# EAGLE design BIM BMI Adapter (EAGLE 5.12)
FUNCTION: JTAG
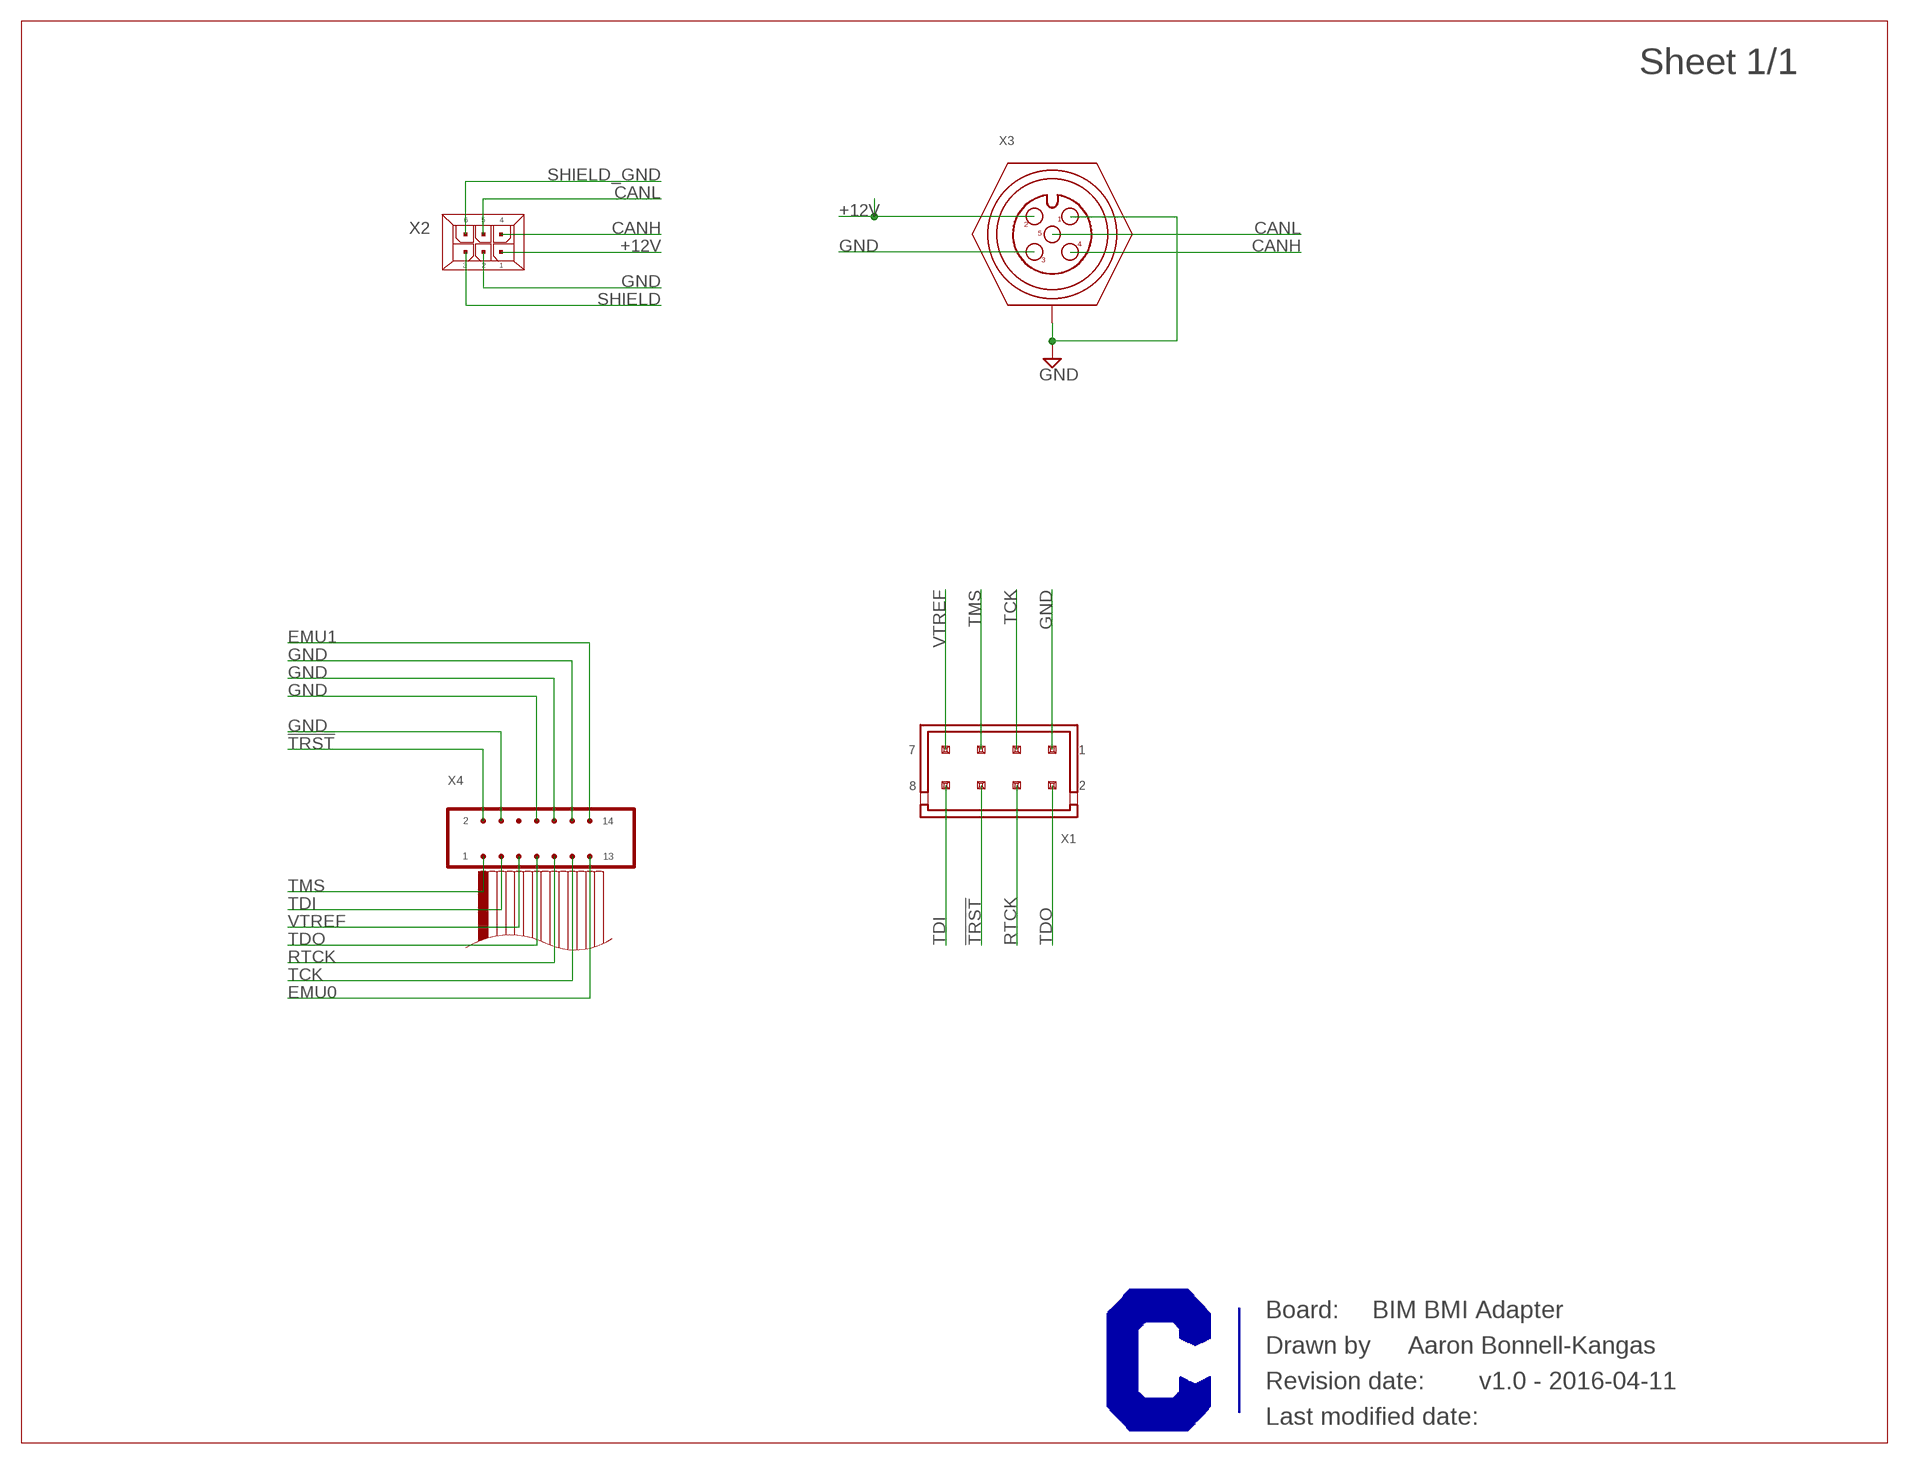
[diagram p0: schematic, sheet 1]

## Parts
X1  AMPMODU_SHROUDED_MALE_HEADER_0.1-RA  [PIN_HEADER_RA_5-103166-2]
X2  MICROFIT-6-RCPT-BMI-RA  [MICROFIT-6-BMI-THROUGH_HOLE-RA-PEG_RETENTION]
X3  M12-5-RA-B2B  [M12-RA-PCB_NO_PEGS]
X4  0.05"_IDC_HEADER  [3240-14-00]

## Nets
!TRST: X1.6 X4.2
+12V: X2.1 X3.2
CANH: X2.4 X3.4
CANL: X2.5 X3.5
EMU0: X4.13
EMU1: X4.14
GND: X1.1 X2.2 X3.1 X3.3 X3.SHIELD X4.4 X4.8 X4.10 X4.12
RTCK: X1.4 X4.9
SHIELD: X2.3
SHIELD_GND: X2.6
TCK: X1.3 X4.11
TDI: X1.8 X4.3
TDO: X1.2 X4.7
TMS: X1.5 X4.1
VTREF: X1.7 X4.5
Unconnected: X4.6

## Notes on the sheet
- BIM BMI Adapter
- Aaron Bonnell-Kangas
- v1.0 - 2016-04-11

## Library data of the parts
X1 = TE:AMPMODU_SHROUDED_MALE_HEADER_0.1: AMPMODU Standard Profile Headers - Shrouded, Double-Row, .100 x .100 Centerline Datasheet: http://datasheet.octopart.com/5-103166-2-Tyco-Electronics-datasheet-11077762.pdf/a>; PARTNO: 5-103166-2
X2 = Molex:MICROFIT-6-RCPT-BMI: Molex Micro-Fit BMI (blind-mate interface) header, 6 circuits, right-angle, through-hole Datasheet: http://www.molex.com/pdm_docs/sd/444280602_sd.pdf; PARTNO: 44428-0602
X3 = Conec:M12-5: http://media.digikey.com/pdf/Data%20Sheets/Conec%20PDFs/43-01208-11_Dwg.pdf; BOM: EXCLUDE
X4 = CNC Tech:0.05"_IDC_HEADER: 3240 Series IDC Wire-To-Board Header, 0.025" Cable Pitch, 0.05" Pin Pitch, 14 Positions Datasheet: http://cnctech.us/pdfs/3240-XX-00.pdf; PARTNO: 3240-14-00

## Board
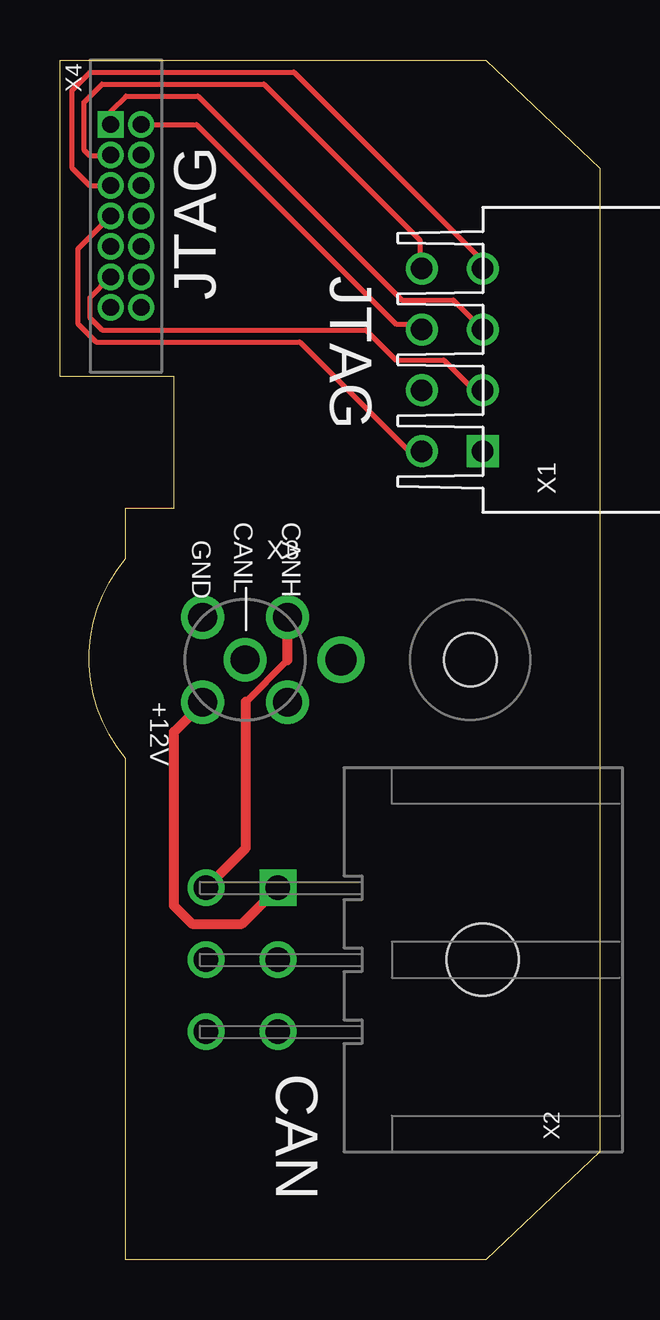
[diagram p1: board, top side]
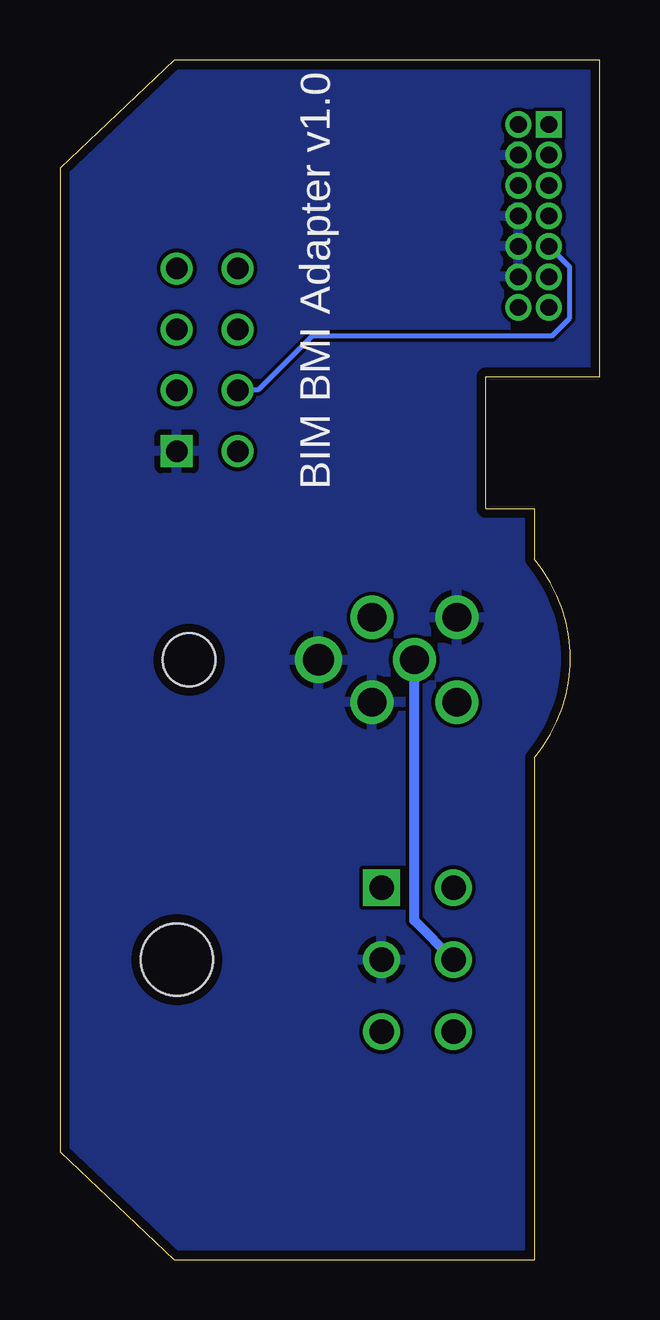
[diagram p2: board, bottom side, seen from below]

Size 22.5 x 50 mm. Coordinates in mm from the lower left corner, seen from the top.
Outline: 0,36.8 0,50 17.75,50 22.5,45.5 22.5,4.5 17.75,0 2.72,0 2.72,20.9 arc-79 2.72,29.2 2.72,31.3 4.75,31.3 4.75,36.8 0,36.8
Copper layers (1*16): Top 0.0356mm / dielectric 1.5011mm / Bottom 0.0356mm
Design rules "OSH Park 2-layer": minimum track width 6mil, minimum drill 13mil, track to track 6mil, track to pad 6mil, pad to pad 6mil, via to via 6mil, smd to smd 6mil, copper to edge 15mil, drill to drill 6mil, minimum pad ring 7mil, minimum via ring 7mil, stop-mask expansion 4mil, vias tented up to drill 25mil, thermal gap 10mil
Holes 2.2 mm at 17.11,25

### Footprints (pad centres in the part's own frame; a part is rotated, then mirrored left to right if it is on the bottom)
PIN_HEADER_RA_5-103166-2 = drill 0.889 square: 1 -3.81,-1.27 | drill 0.889 round: 2 -3.81,1.27; 3 -1.27,-1.27; 4 -1.27,1.27; 5 1.27,-1.27; 6 1.27,1.27; 7 3.81,-1.27; 8 3.81,1.27
MICROFIT-6-BMI-THROUGH_HOLE-RA-PEG_RETENTION = drill 1.02 square: 1 3,-1.5 | drill 1.02 round: 2 0,-1.5; 3 -3,-1.5; 4 3,1.5; 5 0,1.5; 6 -3,1.5 | hole 3: 0,-10.03
M12-RA-PCB_NO_PEGS = drill 1.2 round: 1 -1.768,-1.768; 2 1.768,-1.768; 3 1.768,1.768; 4 -1.768,1.768; 5 0,0 | drill 1.3 round: SHIELD 0,4
3240-14-00 = drill 0.7 pad 1.092 square: 1 -3.81,-0.635 | drill 0.7 pad 1.092 round: 2 -3.81,0.635; 3 -2.54,-0.635; 4 -2.54,0.635; 5 -1.27,-0.635; 6 -1.27,0.635; 7 0,-0.635; 8 0,0.635; 9 1.27,-0.635; 10 1.27,0.635; 11 2.54,-0.635; 12 2.54,0.635; 13 3.81,-0.635; 14 3.81,0.635

### Placement (x,y rotation side)
X1  16.36,37.5 90 top
X2  7.59,12.5 90 top
X3  7.72,25 270 top
X4  2.75,43.5 270 top

### Tracks (layer width: path | path; a pad name or v marks a point on that pad's centre or on a via)
!TRST
  Top 0.2: X4.2 5.69,47.31 14,39 14.86,39 X1.6
+12V
  Top 0.406: X2.1 7.59,14 5.5,14 4.75,14.75 4.75,22 5.95,23.2 X3.2
CANH
  Top 0.3: 7.75,23.25 9.49,24.99
  Top 0.406: X2.4 7.75,17.16 7.75,23.25 | 9.49,24.99 X3.4
CANL
  Bottom 0.406: X2.5 7.72,14.13 X3.5
GND
  pour Bottom: 0.5,50.25 22.5,50.25 22.5,0 0.5,0
RTCK
  Bottom 0.2: X4.9 1.25,41.37 1.25,39.25 2,38.5 12,38.5 14.25,36.25 15.11,36.25 | 15.11,36.25 15.25,36.25 | 15.11,36.25 X1.4
TCK
  Top 0.2: X4.11 1.25,40.09 1.25,39.25 1.75,38.75 12.75,38.75 14,37.5 16,37.5 17.5,36 17.5,36.1 X1.3
TDI
  Top 0.2: X4.3 2.08,46 1.25,46 1,46.25 1,48.25 1.75,49 8.5,49 15,42.5 15,41.4 X1.8
TDO
  Top 0.2: X4.7 0.75,42.13 0.75,39 1.5,38.25 10,38.25 14.75,33.5 14.9,33.5 X1.2
TMS
  Top 0.2: X4.1 2.12,47.87 2.75,48.5 5.75,48.5 14.25,40 16.4,40 X1.5
VTREF
  Top 0.2: X4.5 2.09,44.75 1.25,44.75 0.5,45.5 0.5,48.75 1.25,49.5 9.75,49.5 17.63,41.62 X1.7

### Text on the board
tPlace: JTAG | JTAG | CANL | CANH | GND | +12V | CAN
bPlace: BIM BMI Adapter v1.0